# EAGLE design Sternchen (EAGLE 4.15)
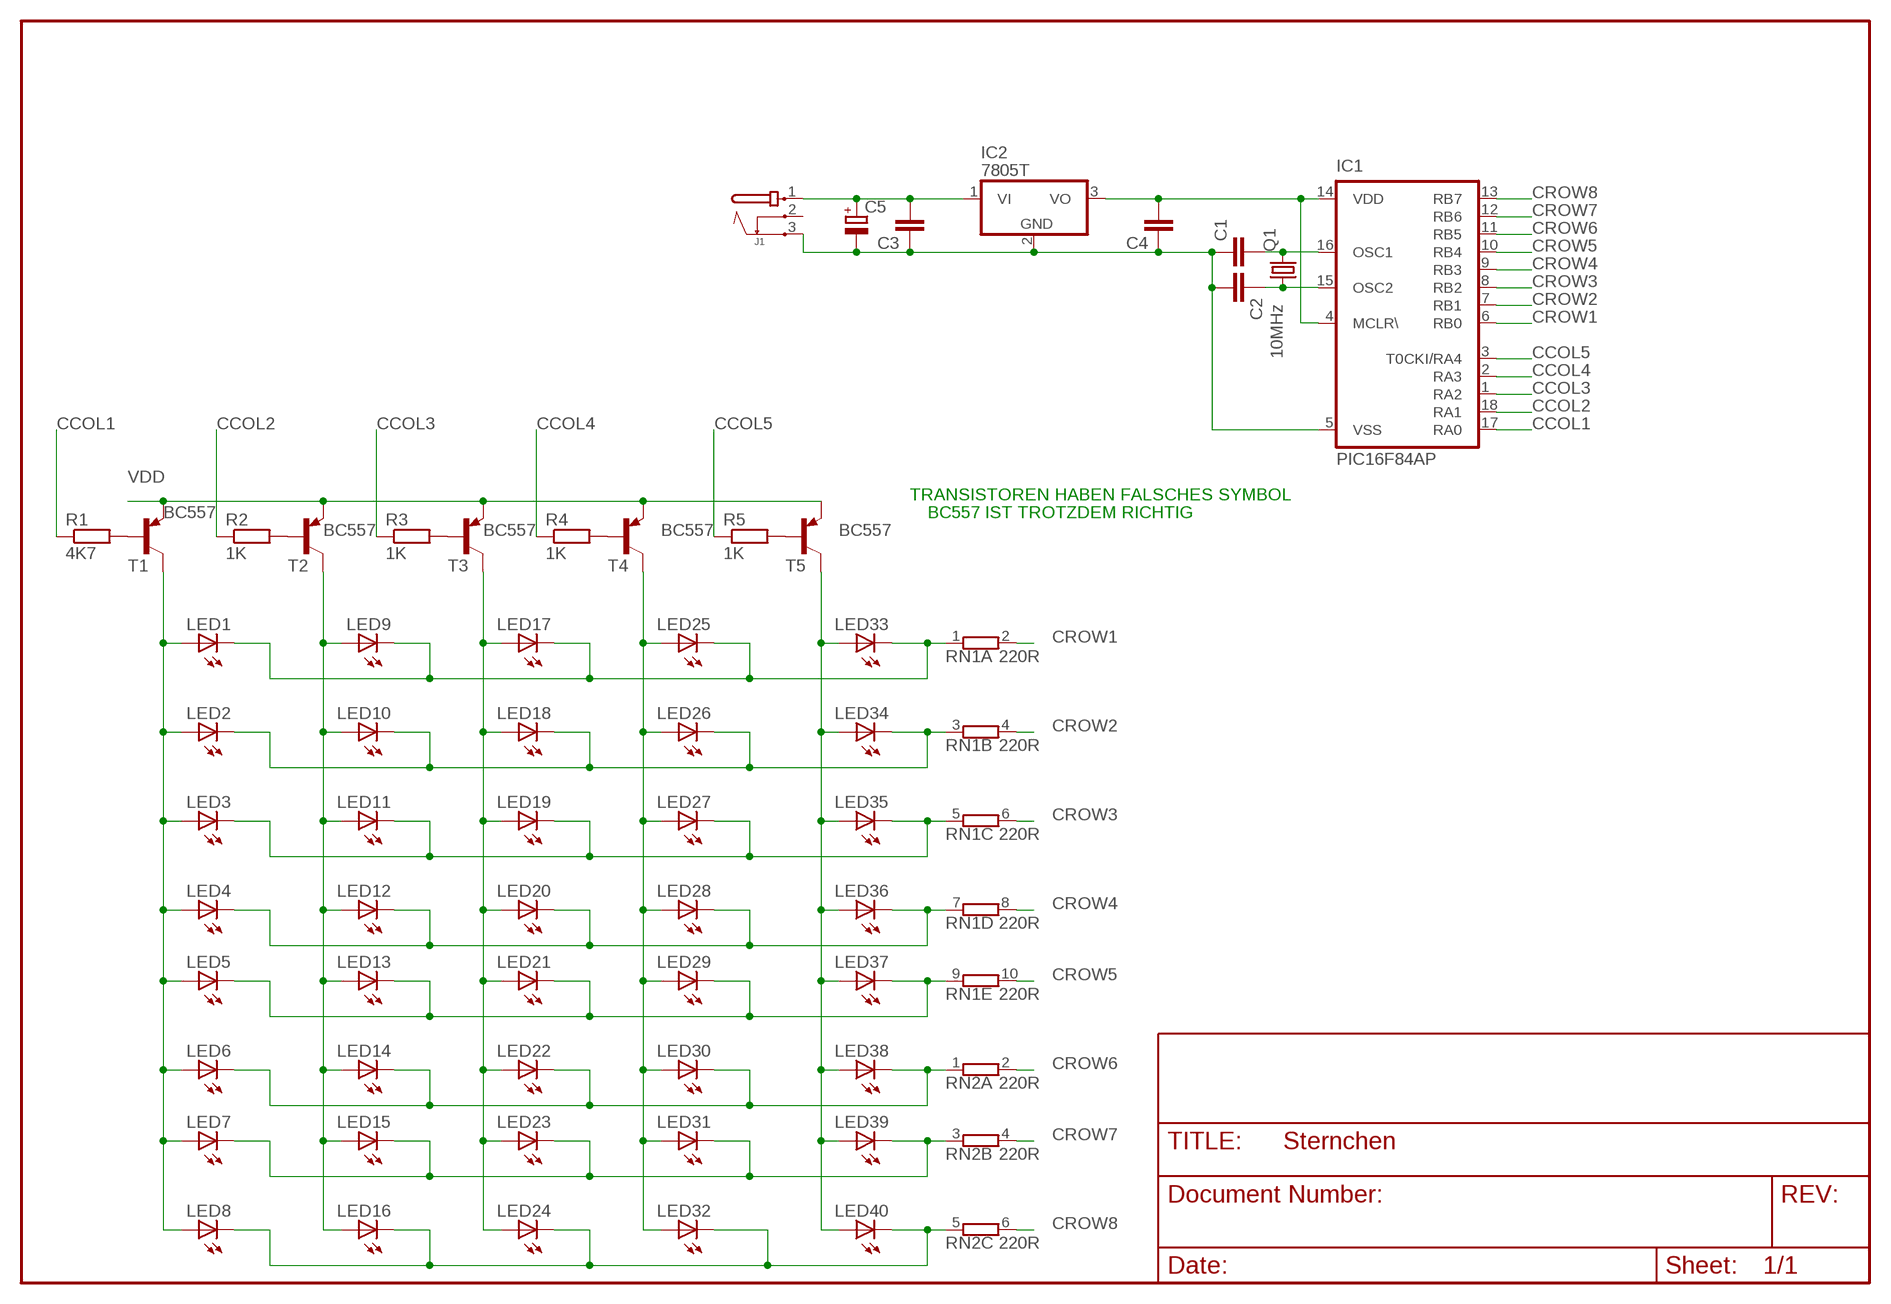
[diagram p0: schematic, sheet 1]

## Parts
C1  C2,5-3  [C2.5-3]
C2  C2,5-3  [C2.5-3]
C3  C2,5-3  [C2.5-3]
C4  C2,5-3  [C2.5-3]
C5  CPOL-EUE1.8-4  [E1,8-4]
IC1  PIC16F84AP  [DIL18]
IC2  7805T  [TO220H]
J1  JACK-PMS  [JACK-PMS]
LED1  LED5MM  [LED5MM]
LED2  LED5MM  [LED5MM]
LED3  LED5MM  [LED5MM]
LED4  LED5MM  [LED5MM]
LED5  LED5MM  [LED5MM]
LED6  LED5MM  [LED5MM]
LED7  LED5MM  [LED5MM]
LED8  LED5MM  [LED5MM]
LED9  LED3MM  [LED3MM]
LED10  LED3MM  [LED3MM]
LED11  LED3MM  [LED3MM]
LED12  LED3MM  [LED3MM]
LED13  LED3MM  [LED3MM]
LED14  LED3MM  [LED3MM]
LED15  LED3MM  [LED3MM]
LED16  LED3MM  [LED3MM]
LED17  LED3MM  [LED3MM]
LED18  LED3MM  [LED3MM]
LED19  LED3MM  [LED3MM]
LED20  LED3MM  [LED3MM]
LED21  LED3MM  [LED3MM]
LED22  LED3MM  [LED3MM]
LED23  LED3MM  [LED3MM]
LED24  LED3MM  [LED3MM]
LED25  LED3MM  [LED3MM]
LED26  LED3MM  [LED3MM]
LED27  LED3MM  [LED3MM]
LED28  LED3MM  [LED3MM]
LED29  LED3MM  [LED3MM]
LED30  LED3MM  [LED3MM]
LED31  LED3MM  [LED3MM]
LED32  LED3MM  [LED3MM]
LED33  LED3MM  [LED3MM]
LED34  LED5MM  [LED5MM]
LED35  LED3MM  [LED3MM]
LED36  LED3MM  [LED3MM]
LED37  LED3MM  [LED3MM]
LED38  LED3MM  [LED3MM]
LED39  LED3MM  [LED3MM]
LED40  LED3MM  [LED3MM]
Q1  10MHz  CRYTALHC49S  [HC49/S]
R1  4K7  R-EU_0204/2V  [0204V]
R2  1K  R-EU_0204/2V  [0204V]
R3  1K  R-EU_0204/2V  [0204V]
R4  1K  R-EU_0204/2V  [0204V]
R5  1K  R-EU_0204/2V  [0204V]
RN1  220R  E5R  [SIL10]
RN2  220R  E5R  [SIL10]
T1  BC557  -PNP-TO92  [TO92]
T2  BC557  -PNP-TO92  [TO92]
T3  BC557  -PNP-TO92  [TO92]
T4  BC557  -PNP-TO92  [TO92]
T5  BC557  -PNP-TO92  [TO92]

## Nets
CCOL1: IC1.17(RA0) R1.1
CCOL2: IC1.18(RA1) R2.1
CCOL3: IC1.1(RA2) R3.1
CCOL4: IC1.2(RA3) R4.1
CCOL5: IC1.3(T0CKI/RA4) R5.1
COL1: LED1.A LED2.A LED3.A LED4.A LED5.A LED6.A LED7.A LED8.A T1.3(C)
COL2: LED9.A LED10.A LED11.A LED12.A LED13.A LED14.A LED15.A LED16.A T2.3(C)
COL3: LED17.A LED18.A LED19.A LED20.A LED21.A LED22.A LED23.A LED24.A T3.3(C)
COL4: LED25.A LED26.A LED27.A LED28.A LED29.A LED30.A LED31.A LED32.A T4.3(C)
COL5: LED33.A LED34.A LED35.A LED36.A LED37.A LED38.A LED39.A LED40.A T5.3(C)
CROW1: IC1.6(RB0) RN1.2
CROW2: IC1.7(RB1) RN1.4
CROW3: IC1.8(RB2) RN1.6
CROW4: IC1.9(RB3) RN1.8
CROW5: IC1.10(RB4) RN1.10
CROW6: IC1.11(RB5) RN2.2
CROW7: IC1.12(RB6) RN2.4
CROW8: IC1.13(RB7) RN2.6
N$1: C1.2 IC1.16(OSC1) Q1.2
N$2: C2.1 IC1.15(OSC2) Q1.1
N$3: R1.2 T1.2(B)
N$4: C3.2 C5.+ IC2.1(VI) J1.1
N$5: R2.2 T2.2(B)
N$6: C1.1 C2.2 C3.1 C4.1 C5.- IC1.5(VSS) IC2.2(GND) J1.3
N$7: R3.2 T3.2(B)
N$8: R4.2 T4.2(B)
N$9: R5.2 T5.2(B)
ROW1: LED1.K(C) LED9.K(C) LED17.K(C) LED25.K(C) LED33.K(C) RN1.1
ROW2: LED2.K(C) LED10.K(C) LED18.K(C) LED26.K(C) LED34.K(C) RN1.3
ROW3: LED3.K(C) LED11.K(C) LED19.K(C) LED27.K(C) LED35.K(C) RN1.5
ROW4: LED4.K(C) LED12.K(C) LED20.K(C) LED28.K(C) LED36.K(C) RN1.7
ROW5: LED5.K(C) LED13.K(C) LED21.K(C) LED29.K(C) LED37.K(C) RN1.9
ROW6: LED6.K(C) LED14.K(C) LED22.K(C) LED30.K(C) LED38.K(C) RN2.1
ROW7: LED7.K(C) LED15.K(C) LED23.K(C) LED31.K(C) LED39.K(C) RN2.3
ROW8: LED8.K(C) LED16.K(C) LED24.K(C) LED32.K(C) LED40.K(C) RN2.5
VDD: C4.2 IC1.4(MCLR\) IC1.14(VDD) IC2.3(VO) T1.1(E) T2.1(E) T3.1(E) T4.1(E) T5.1(E)
Unconnected: J1.2 RN2.7 RN2.8 RN2.9 RN2.10

## Notes on the sheet
- TRANSISTOREN HABEN FALSCHES SYMBOL
- BC557 IST TROTZDEM RICHTIG

## Library data of the parts
C1-C4 = capacitor-wima:C: CAPACITOR naming: grid - package width
C5 = rcl:CPOL-EU: POLARIZED CAPACITOR, European symbol
IC1 = microchip:PIC16F8*: MICROCONTROLLER 8-Bit PIC16F8X Family - CMOS Flash/EEPROM Pin Compatible : PIC16F83, PIC16CR83, PIC16F84A, PIC16CR84 see also PIC16C*
IC2 = linear:78*: Positive VOLTAGE REGULATOR Source: http://cache.national.com/ds/LM/LM78L05.pdf http://www.fairchildsemi.com/ds/LM/LM7805.pdf
J1 = POWER-IN:JACK-PMS
LED1-LED40 = led:LED: LED OSRAM: - CHIPLED LG R971, LG N971, LY N971, LG Q971, LY Q971, LO R971, LY R971 LH N974, LH R974 LS Q976, LO Q976, LY Q976 LO Q996 - Hyper CHIPLED LW Q18S LB Q993, LB Q99A, LB R99A - SideLED LS A670, LO A670, LY A670, LG A670, LP A670 LB A673, LV A673, LT A673, LW A673 LH A674 LY A675 LS A676, LA A676, LO A676, LY A676, LW A676 LS A679, LY A679, LG A679 - Hyper Micro SIDELED® LS Y876, LA Y876, LO Y876, LY Y876 LT Y87S - SmartLED LW L88C, LW L88S LB L89C, LB L89S, LG L890 LS L89K, LO L89K, LY L89K LS L896, LA L896, LO L896, LY L896 - TOPLED LS T670, LO T670, LY T670, LG T670, LP T670 LSG T670, LSP T670, LSY T670, LOP T670, LYG T670 LG T671, LOG T671, LSG T671 LB T673, LV T673, LT T673, LW T673 LH T674 LS T676, LA T676, LO T676, LY T676, LB T676, LH T676, LSB T676, LW T676 LB T67C, LV T67C, LT T67C, LS T67K, LO T67K, LY T67K, LW E67C LS E67B, LA E67B, LO E67B, LY E67B, LB E67C, LV E67C, LT E67C LW T67C LS T679, LY T679, LG T679 LS T770, LO T770, LY T770, LG T770, LP T770 LB T773, LV T773, LT T773, LW T773 LH T774 LS E675, LA E675, LY E675, LS T675 LS T776, LA T776, LO T776, LY T776, LB T776 LHGB T686 LT T68C, LB T68C - Hyper Mini TOPLED® LB M676 - Mini TOPLED Santana® LG M470 LS M47K, LO M47K, LY M47K Source: http://www.osram.convergy.de/
Q1 = crystal:CRYTAL: CRYSTAL
R1-R5 = rcl:R-EU_: RESISTOR, European symbol
RN1 RN2 = resistor-sil:E5R: SIL RESISTOR
T1-T5 = transistor:*-PNP-: PNP Transistror

## Net classes
0 default: width 0.5 mm

## Board
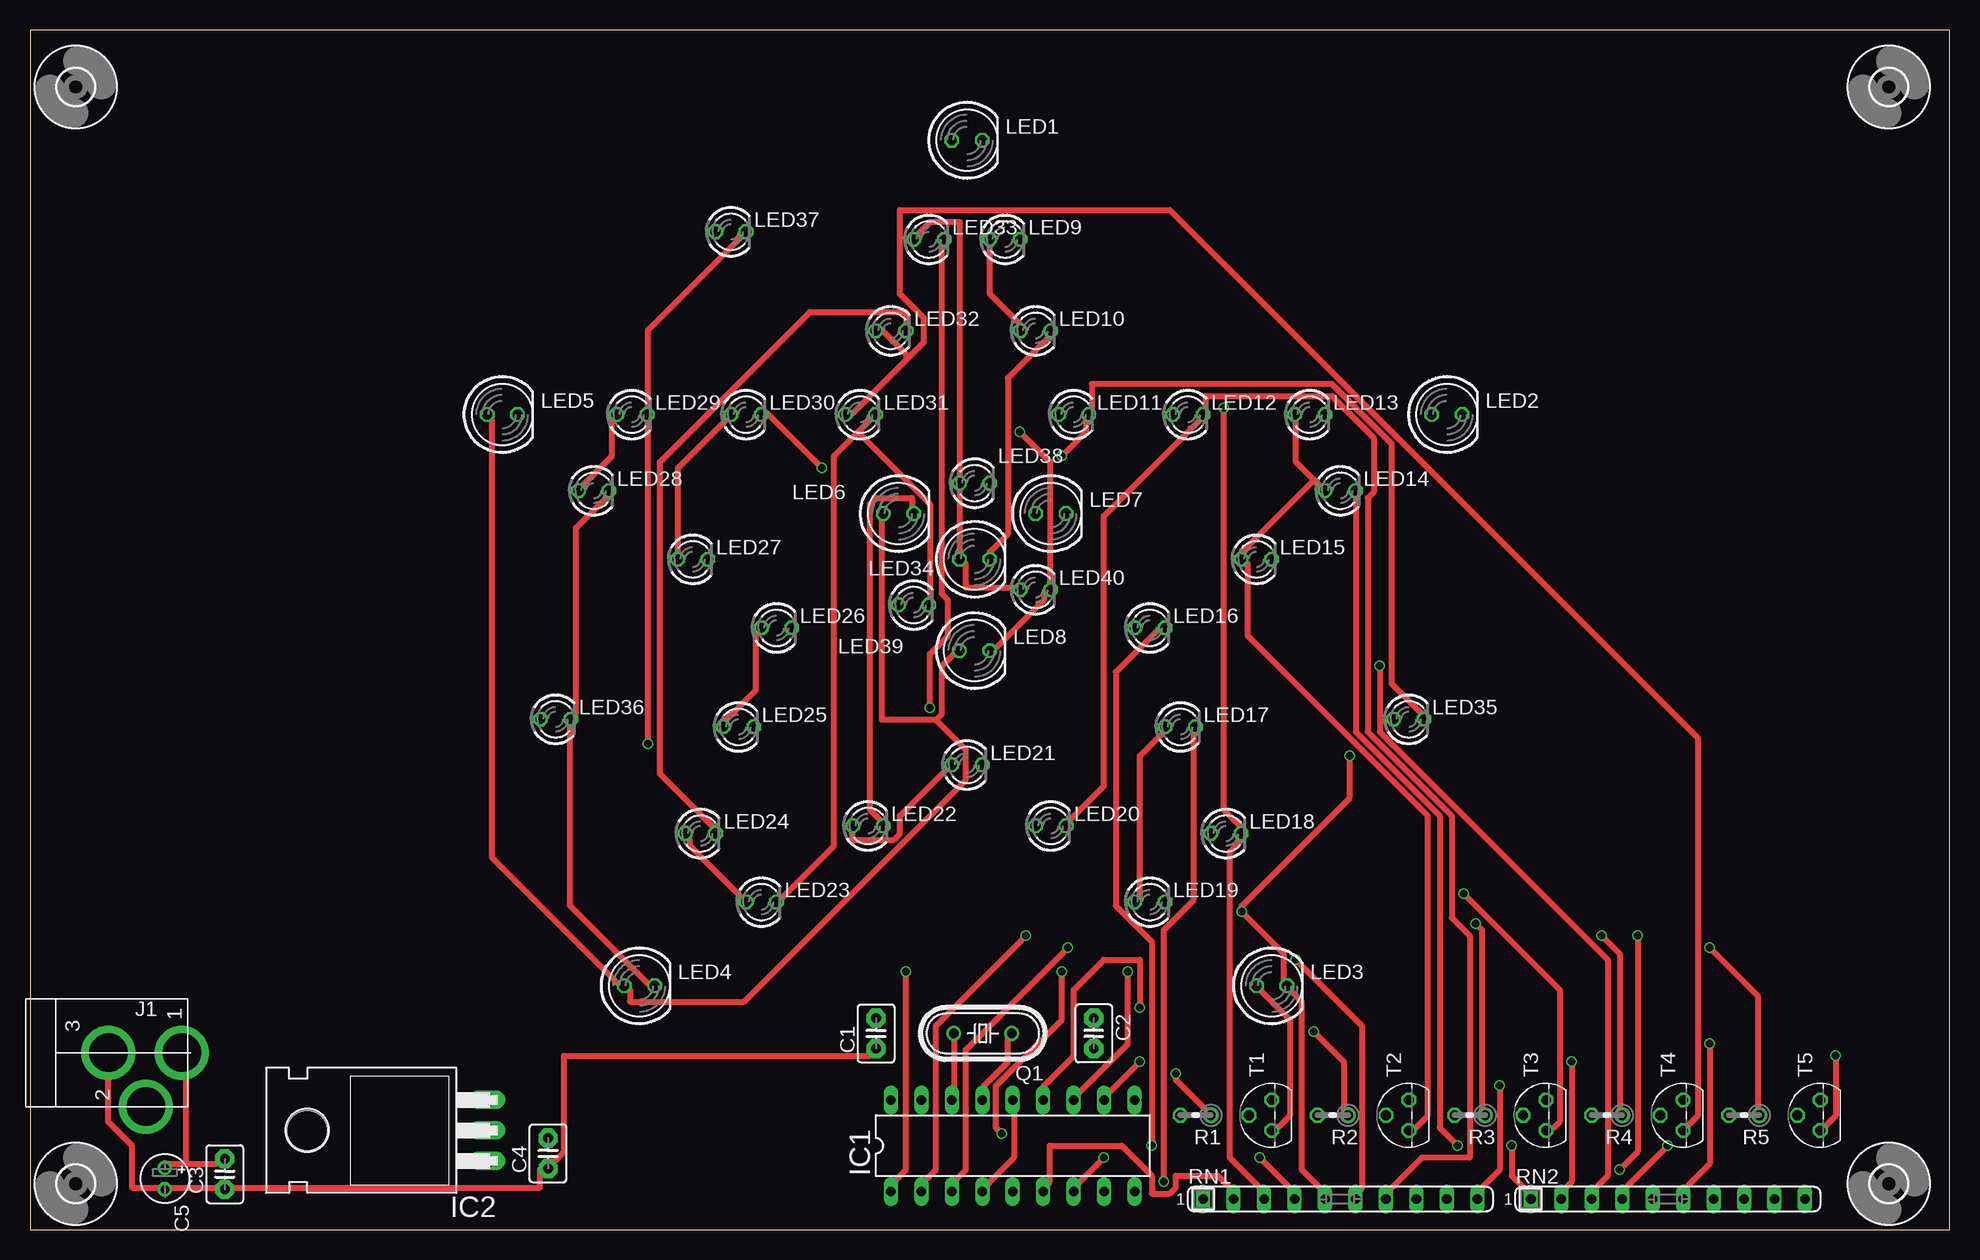
[diagram p1: board, top side]
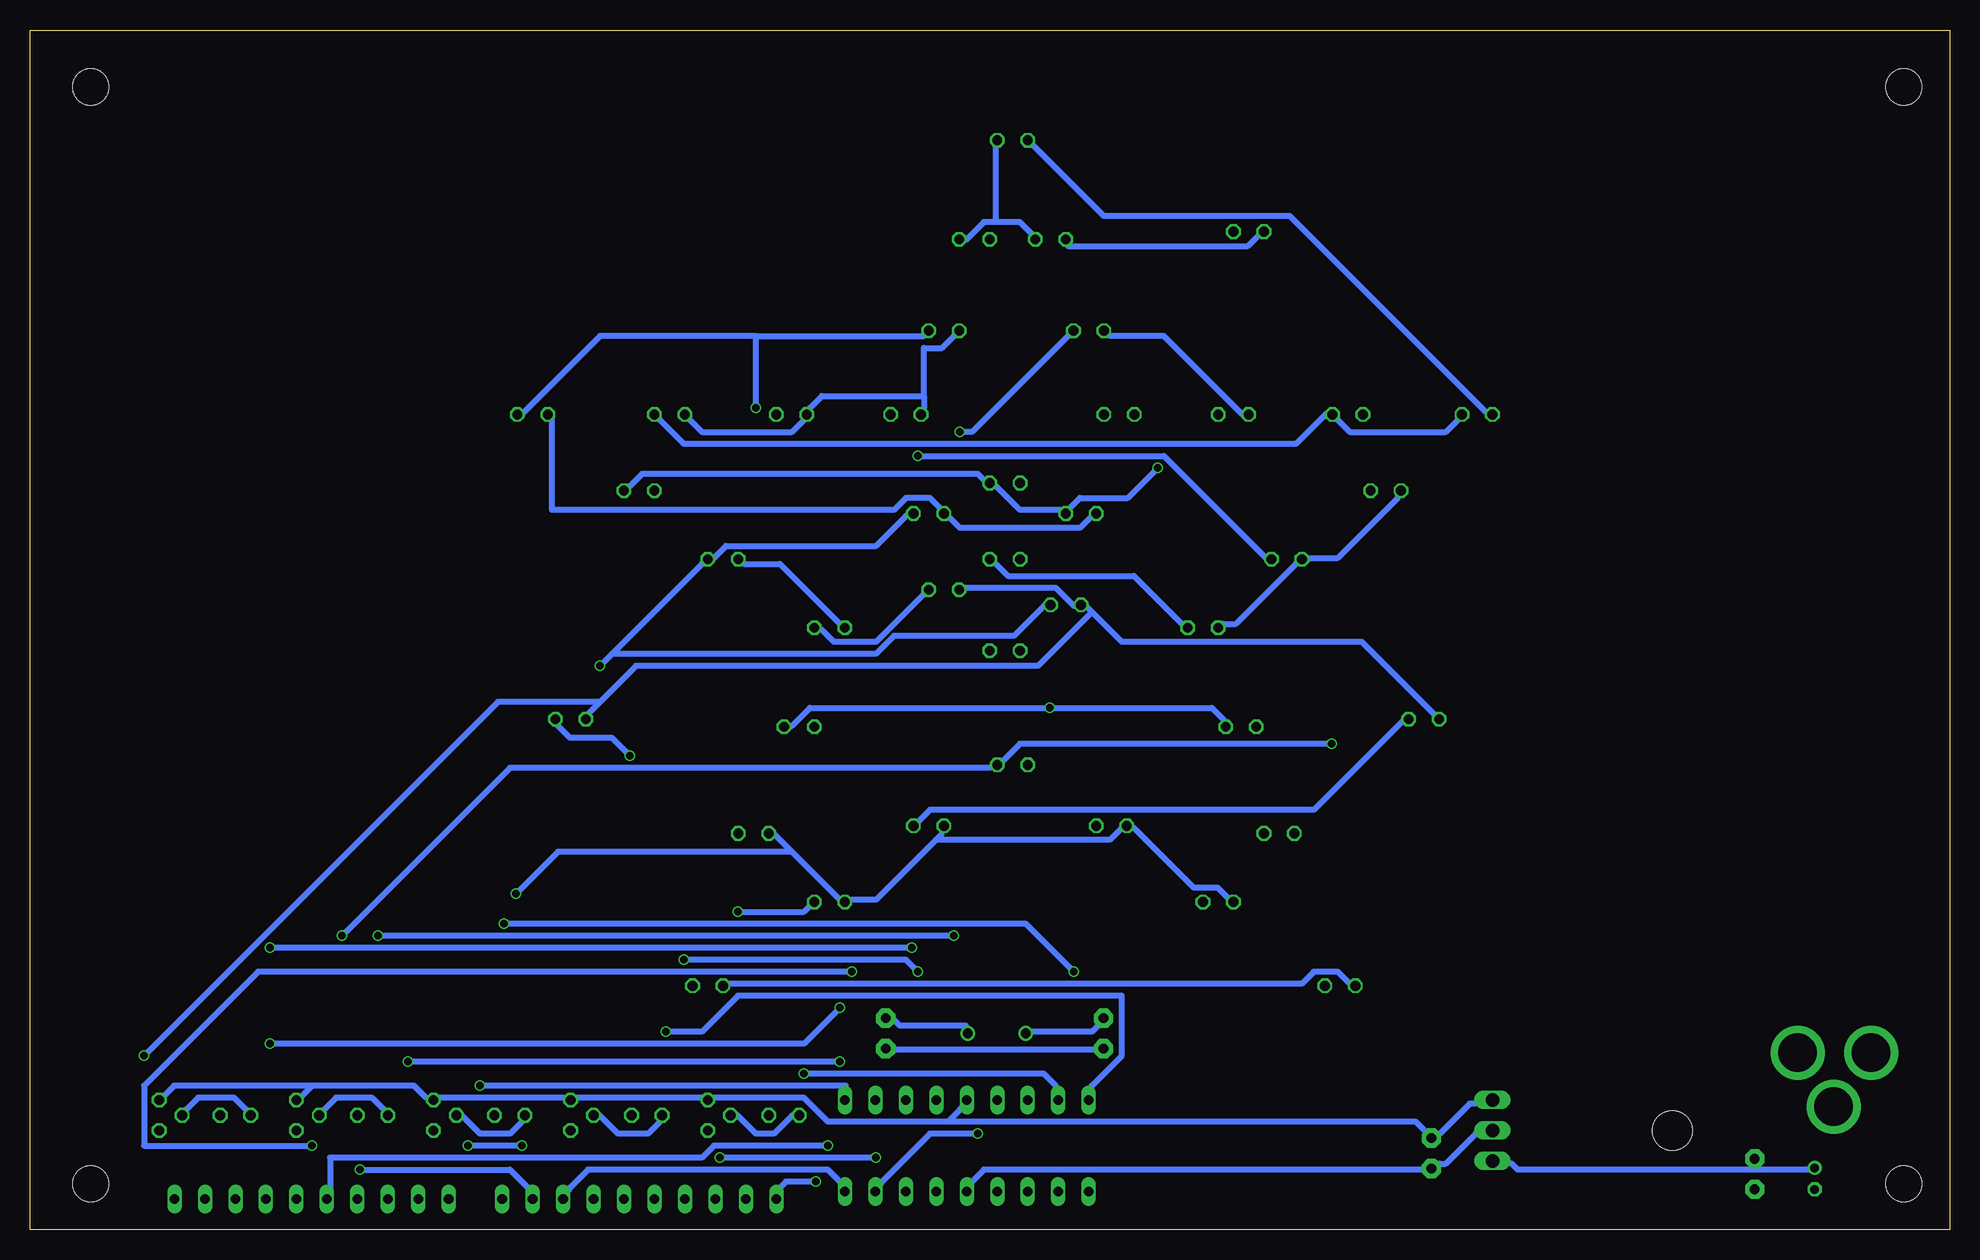
[diagram p2: board, bottom side, seen from below]

Size 160 x 100 mm. Coordinates in mm from the lower left corner, seen from the top.
Outline: 0,0 160,0 160,100 0,100 0,0
Copper layers (1*16): Top 0.035mm / dielectric 1.5mm / Bottom 0.035mm
Design rules "PCB-POOL": minimum track width 6mil, minimum drill 12mil, track to track 6mil, track to pad 6mil, pad to pad 6mil, via to via 6mil, smd to smd 6mil, copper to edge 20mil, drill to drill 8mil, minimum pad ring 8mil, minimum via ring 6mil, stop-mask expansion 3mil, vias tented up to drill 0mil, thermal gap 8mil

### Footprints (pad centres in the part's own frame; a part is rotated, then mirrored left to right if it is on the bottom)
C2.5-3 = drill 0.813 pad 1.6 octagon: 1 -1.27,0; 2 1.27,0
E1,8-4 = drill 0.711 pad 1.168 round: + -0.889,0 | drill 0.711 pad 1.168 octagon: - 0.889,0
DIL18 = drill 0.813 long: 1 -10.16,-3.81; 2 -7.62,-3.81; 3 -5.08,-3.81; 4 -2.54,-3.81; 5 0,-3.81; 6 2.54,-3.81; 7 5.08,-3.81; 8 7.62,-3.81; 9 10.16,-3.81; 10 10.16,3.81; 11 7.62,3.81; 12 5.08,3.81; 13 2.54,3.81; 14 0,3.81; 15 -2.54,3.81; 16 -5.08,3.81; 17 -7.62,3.81; 18 -10.16,3.81
TO220H = drill 1.118 long: 1 -2.54,-10.16; 2 0,-10.16; 3 2.54,-10.16 | hole 3.302: 0,4.826
JACK-PMS = drill 3.2 pad 4.5 round: 1 -0.5,-3.31; 2 -5,-0.31; 3 -0.5,2.809
LED5MM = drill 0.813 octagon: A -1.27,0; K 1.27,0
LED3MM = drill 0.813 octagon: A -1.27,0; K 1.27,0
HC49/S = drill 0.813 round: 1 -2.413,0; 2 2.413,0
0204V = drill 0.813 octagon: 1 -1.27,0; 2 1.27,0
SIL10 = drill 0.813 long: 1 -11.43,0; 2 -8.89,0; 3 -6.35,0; 4 -3.81,0; 5 -1.27,0; 6 1.27,0; 7 3.81,0; 8 6.35,0; 9 8.89,0; 10 11.43,0
TO92 = drill 0.813 octagon: 1 1.27,0; 2 0,1.905; 3 -1.27,0
3,0 = hole 3: 0,0

### Placement (x,y rotation side)
C1  70.53,16.35 90 top
C2  88.67,16.35 270 top
C3  16.24,4.62 90 top
C4  43.18,6.35 90 top
C5  11.24,4.24 270 top
IC1  81.92,6.99 0 top
IC2  27.94,8.26 90 top
J1  9.35,15.24 90 top
LED1  78.11,90.81 0 top
LED2  118.11,67.94 0 top
LED3  103.5,20.32 0 top
LED4  50.8,20.32 0 top
LED5  39.37,67.94 0 top
LED6  72.39,59.69 0 top
LED7  85.09,59.69 0 top
LED8  78.74,48.26 0 top
LED9  81.28,82.55 0 top
LED10  83.82,74.93 0 top
LED11  87,67.94 0 top
LED12  96.52,67.94 0 top
LED13  106.68,67.94 0 top
LED14  109.22,61.59 0 top
LED15  102.23,55.88 0 top
LED16  93.34,50.16 0 top
LED17  95.89,41.91 0 top
LED18  99.69,33.02 0 top
LED19  93.34,27.3 0 top
LED20  85.09,33.66 0 top
LED21  78.11,38.73 0 top
LED22  69.85,33.66 0 top
LED23  60.96,27.3 0 top
LED24  55.88,33.02 0 top
LED25  59.05,41.91 0 top
LED26  62.23,50.16 0 top
LED27  55.24,55.88 0 top
LED28  46.99,61.59 0 top
LED29  50.16,67.94 0 top
LED30  59.69,67.94 0 top
LED31  69.22,67.94 0 top
LED32  71.75,74.93 0 top
LED33  74.93,82.55 0 top
LED34  78.74,55.88 0 top
LED35  114.94,42.55 0 top
LED36  43.81,42.55 0 top
LED37  58.42,83.19 0 top
LED38  78.74,62.23 0 top
LED39  73.66,52.07 0 top
LED40  83.82,53.34 0 top
Q1  79.42,16.35 180 top
R1  97.16,9.53 180 top
R2  108.58,9.53 180 top
R3  120.02,9.53 180 top
R4  131.44,9.53 180 top
R5  142.88,9.53 180 top
RN1  109.22,2.54 0 top
RN2  136.53,2.54 0 top
T1  103.5,9.53 90 top
T2  114.94,9.53 90 top
T3  126.36,9.53 90 top
T4  137.79,9.53 90 top
T5  149.22,9.53 90 top
U$1  [3,0]  3.81,95.25 0 top
U$2  [3,0]  154.94,95.25 0 top
U$3  [3,0]  154.94,3.81 0 top
U$4  [3,0]  3.81,3.81 0 top

### Tracks (layer width: path | path; a pad name or v marks a point on that pad's centre or on a via)
CCOL1  (via drill 0.61)
  Top 0.5: v95.5,13 95.5,12.5 98,10 R1.1
  Bottom 0.5: v95.5,13 75.5,13 74.5,12 IC1.17
CCOL2  (via drill 0.61)
  Top 0.5: v107,16.5 109.5,14 109.5,10 R2.1
  Bottom 0.5: v107,16.5 104,16.5 101,19.5 69,19.5 69,14.5 71.5,12 IC1.18
CCOL3  (via drill 0.61)
  Top 0.5: v73,21.5 73,5 72,4 IC1.1 | v120.5,25.5 121,25 121,10 R3.1
  Bottom 0.5: v73,21.5 77,25.5 v120.5,25.5
CCOL4  (via drill 0.61)
  Top 0.5: v83,24.5 75.5,17 75.5,5 74.5,4 IC1.2 | v131,24.5 132.5,23 132.5,10 R4.1
  Bottom 0.5: v83,24.5 v131,24.5
CCOL5  (via drill 0.61)
  Top 0.5: v86.5,23.5 78,15 78,5 77,4 IC1.3 | v140,23.5 144,19.5 144,10 R5.1
  Bottom 0.5: v86.5,23.5 v140,23.5
COL1
  Top 0.5: 75.5,42.5 76,43 76,47 77,48 LED8.A | 75.5,42.5 71,42.5 71,59.5 LED6.A | T1.3 104,8.5 105,9.5 105,17.5 102.5,20 LED3.A | LED5.A 38.5,67.5 38.5,31 49,20.5 LED4.A 50,20 50,19 59.5,19 78,37.5 78,40 75.5,42.5
  Bottom 0.5: LED6.A 71.5,59.5 72.5,58.5 82.5,58.5 83.5,59.5 LED7.A 84,60 85,61 87,61 88,60 116.5,60 116.5,67.5 LED2.A | LED1.A 76.5,90.5 70.5,84.5 55,84.5 38.5,68 LED5.A | LED3.A 102,20.5 54,20.5 53,21.5 51,21.5 50,20.5 LED4.A
COL2
  Top 0.5: LED10.A 82.5,75.5 80,78 80,82 LED9.A | 107,62.5 105.5,64 105.5,67.5 LED13.A | 107,62.5 107.5,62 LED14.A | T2.3 115.5,8.5 116.5,9.5 116.5,34.5 101.5,49.5 101.5,55.5 LED15.A 101,56.5 107,62.5
  Bottom 0.5: 85.5,69.5 85.5,73.5 84,73.5 83,74.5 LED10.A | 85.5,69.5 85.5,68.5 LED11.A | 85.5,69.5 94,69.5 95,68.5 LED12.A 95.5,67.5 96.5,66.5 104,66.5 105,67.5 LED13.A | LED16.A 92.5,50.5 97.5,55.5 100.5,55.5 LED15.A
COL3  (via drill 0.61)
  Top 0.5: LED23.A 59.5,27.5 55,32 55,32.5 LED24.A | LED21.A 76.5,38.5 72.5,34.5 72.5,33 72,32.5 68.5,32.5 68.5,33 LED22.A | v119.5,28 127.5,20 127.5,9 127,8.5 T3.3 | LED17.A 94.5,41.5 92.5,39.5 92.5,27.5 LED19.A
  Bottom 0.5: LED23.A 60,27.5 61,28.5 63,28.5 68,33.5 LED22.A 69,33.5 70,32.5 84.5,32.5 | 96.5,31.5 98,33 LED18.A | 96.5,31.5 92.5,27.5 LED19.A 91.5,27.5 89.5,27.5 84.5,32.5 | v119.5,28 116,31.5 96.5,31.5 | 84.5,32.5 84,33 LED20.A
COL4
  Top 0.5: LED28.A 46,62 48.5,64.5 48.5,67.5 LED29.A | LED25.A 58,42.5 60.5,45 60.5,50 LED26.A | LED30.A 58,67.5 54,63.5 54,56.5 LED27.A | 73,72.5 68.5,68 LED31.A | 73,72.5 74.5,74 74.5,76 72.5,78 72.5,85 95,85 139,41 139,9.5 138,8.5 T4.3 | 73,72.5 73,73 71,75 LED32.A
  Bottom 0.5: LED26.A 60.5,50.5 59.5,50.5 54.5,55.5 LED27.A 53.5,56 51,56 46,61 LED28.A | LED30.A 59,68 65.5,74.5 70,74.5 LED32.A
COL5  (via drill 0.61)
  Top 0.5: LED40.A 82,53.5 78,53.5 78,55.5 LED34.A 77.5,56.5 77.5,62 LED38.A 77.5,62.5 77.5,84 75,84 74,83 LED33.A | v150.5,14.5 150.5,9.5 149.5,8.5 T5.3
  Bottom 0.5: LED37.A 57.5,83 58.5,82 73.5,82 LED33.A | 71.5,51.5 72,52 LED39.A 73,52 74.5,53.5 82,53.5 LED40.A | 71.5,51.5 69,49 49,49 LED36.A | 112.5,44 109.5,47 76,47 71.5,51.5 | 112.5,44 113.5,43 LED35.A | v150.5,14.5 121,44 112.5,44
CROW1
  Top 0.5: RN1.2 100,3.5 99,4.5 95.5,4.5 95.5,3.5 95,3 93.5,3 93.5,4.5 91,7 85,7 85,4 IC1.6
CROW2  (via drill 0.61)
  Top 0.5: v102.5,6 105,3.5 RN1.4 | v89.5,6 87.5,4 IC1.7
  Bottom 0.5: v89.5,6 v102.5,6
CROW3  (via drill 0.61)
  Top 0.5: v81,8 80.5,8.5 80.5,12 86,17.5 v86,21.5 | v105.5,22.5 111,17 111,3.5 RN1.6
  Bottom 0.5: v81,8 85,8 89,4 IC1.8 | v86,21.5 87,22.5 v105.5,22.5
CROW4
  Bottom 0.5: IC1.9 92.5,4 93.5,5 113.5,5 115,3.5 RN1.8
CROW5  (via drill 0.61)
  Top 0.5: v122.5,12 122.5,5 121,3.5 RN1.10
  Bottom 0.5: v122.5,12 92,12 IC1.10
CROW6  (via drill 0.61)
  Top 0.5: v92.5,14 90,11.5 IC1.11 | v128.5,14 128.5,4 128,3.5 RN2.2
  Bottom 0.5: v92.5,14 v128.5,14
CROW7  (via drill 0.61)
  Top 0.5: v91.5,21.5 91.5,15.5 87.5,11.5 IC1.12 | v136.5,7 133,3.5 RN2.4
  Bottom 0.5: v91.5,21.5 141,21.5 150.5,12 150.5,7 v136.5,7
CROW8  (via drill 0.61)
  Top 0.5: v92.5,18.5 92.5,22.5 89.5,22.5 87,20 87,14.5 84.5,12 IC1.13 | v140,15.5 140,5.5 138,3.5 RN2.6
  Bottom 0.5: v92.5,18.5 95.5,15.5 v140,15.5
N$1
  Top 0.5: IC1.16 77,12 77,16 Q1.2
  Bottom 0.5: C1.2 71,17 71.5,16.5 76.5,16.5 Q1.2
N$2
  Top 0.5: IC1.15 79.5,12 81.5,14 81.5,16 Q1.1
  Bottom 0.5: C2.1 88,17.5 87.5,17 82,17 Q1.1
N$3
  Bottom 0.5: R1.2 96.5,9.5 98,8 99.5,8 101,9.5 T1.2
N$4
  Top 0.5: 13,5.5 15.5,5.5 C3.2 | 13,5.5 11.5,5.5 C5.+ | 13,5.5 13,12.5 J1.1
  Bottom 0.5: IC2.1 36.5,5.5 36,5 11.5,5 C5.+
N$5
  Bottom 0.5: R2.2 107.5,9 108.5,8 111,8 112.5,9.5 T2.2
N$6
  Top 0.5: J1.3 6.5,12.5 6.5,9 8.5,7 8.5,3.5 11,3.5 C5.- 11.5,3.5 15.5,3.5 C3.1 17,3.5 42.5,3.5 42.5,5 C4.1 43.5,5.5 44.5,6.5 44.5,14.5 70,14.5 C1.1
  Bottom 0.5: C1.1 71,15 88,15 C2.2 | IC1.5 81.5,4 80.5,5 43.5,5 C4.1 42.5,5.5 42,5.5 39.5,8 IC2.2
N$7
  Bottom 0.5: R3.2 119,9 120,8 122.5,8 124,9.5 T3.2
N$8
  Bottom 0.5: R4.2 130.5,10 131.5,11 134.5,11 135.5,10 T4.2
N$9
  Bottom 0.5: R5.2 142,10 143,11 146,11 147,10 T5.2
ROW1  (via drill 0.61)
  Top 0.5: v94.5,4 94.5,25 97,27.5 97,41.5 LED17.K | v75,43.5 75,48 76.5,49.5 76.5,52.5 76,53 76,82 LED33.K
  Bottom 0.5: 79.5,84 80.5,84 82,82.5 LED9.K | 79.5,84 77.5,84 76.5,83 LED33.K | 79.5,84 79.5,90.5 LED1.K | LED25.K 60.5,42.5 61.5,43.5 v75,43.5 95,43.5 96.5,42 LED17.K | v94.5,4 97,4 97.5,3.5 RN1.1
ROW2  (via drill 0.61)
  Top 0.5: RN1.3 102.5,3.5 100,6 100,31.5 101,32.5 LED18.K 101,33.5 99.5,35 v99.5,68.5 | LED10.K 85,74.5 81.5,71 81.5,58 80,56.5 LED34.K
  Bottom 0.5: LED26.K 64,50.5 68,54.5 78.5,54.5 79.5,55.5 LED34.K | 99.5,74.5 85.5,74.5 LED10.K | 99.5,74.5 112.5,74.5 119,68 LED2.K | v99.5,68.5 99.5,74.5
ROW3  (via drill 0.61)
  Top 0.5: RN1.5 107.5,3.5 106,5 106,19 105,20 LED3.K 104.5,20.5 104.5,23 v101,26.5 101,27 110,36 v110,39.5 | LED35.K 116,43 113.5,45.5 113.5,65.5 108.5,70.5 88.5,70.5 88.5,68.5 LED11.K 88,67.5 88,66.5 v86,64.5
  Bottom 0.5: v101,26.5 95.5,26.5 95,27 LED19.K | v86,64.5 65.5,64.5 57,56 LED27.K | v110,39.5 111.5,41 115,41 116,42 LED35.K
ROW4
  Top 0.5: LED4.K 51.5,20.5 45,27 45,42 LED36.K 45.5,43 45.5,58.5 48,61 LED28.K | LED20.K 86.5,34 89.5,37 89.5,59.5 97.5,67.5 LED12.K 98,68.5 98,69.5 108.5,69.5 112,66 112,61.5 111.5,61 111.5,41.5 118.5,34.5 118.5,26 120,24.5 120,6 116,6 113.5,3.5 RN1.7
  Bottom 0.5: LED36.K 45.5,42.5 53,35 85,35 86,34 LED20.K
ROW5  (via drill 0.61)
  Top 0.5: v51.5,40.5 51.5,67.5 LED29.K 51.5,68.5 51.5,75 59.5,83 LED37.K | v132.5,5 134,6.5 v134,24.5
  Bottom 0.5: v51.5,40.5 77.5,40.5 79,39 LED21.K 80,38.5 120,38.5 v134,24.5 | v132.5,5 120,5 118.5,3.5 RN1.9 | LED5.K 41,67.5 42,66.5 50,66.5 51,67.5 LED29.K 52,68 54.5,65.5 105.5,65.5 107.5,67.5 LED13.K
ROW6  (via drill 0.61)
  Top 0.5: LED22.K 71,34 70,35 70,60.5 70.5,61 73.5,61 73.5,60 LED6.K | v66,63.5 61.5,68 LED30.K | v123.5,7 123.5,4.5 124.5,3.5 RN2.1 | v119,7 117.5,8.5 117.5,34.5 110.5,41.5 110.5,61 LED14.K
  Bottom 0.5: v66,63.5 68.5,61 72.5,61 73.5,60 LED6.K 74,60 77.5,60 79.5,62 LED38.K 80.5,62.5 81,63 109,63 110,62 LED14.K | v119,7 v123.5,7
ROW7  (via drill 0.61)
  Top 0.5: 69,66.5 70,67.5 LED31.K | 69,66.5 67,64.5 67,32 62.5,27.5 LED23.K | 69,66.5 75,60.5 75,52.5 LED39.K | v112.5,47 112.5,41.5 131.5,22.5 131.5,4.5 130.5,3.5 RN2.3
  Bottom 0.5: 111.5,48 104,55.5 LED15.K 103,56 102,57 89.5,57 87,59.5 LED7.K | 111.5,48 v112.5,47 | 111.5,48 89.5,48 88,49.5 78,49.5 75.5,52 LED39.K
ROW8  (via drill 0.61)
  Top 0.5: LED24.K 57,33.5 52.5,38 52.5,64 65,76.5 73,76.5 73,75.5 LED32.K | LED8.K 80.5,48.5 84.5,52.5 84.5,53 LED40.K 85,54 85,64 v82.5,66.5 | v93.5,7 93.5,24 90.5,27 90.5,46.5 94,50 LED16.K
  Bottom 0.5: v93.5,7 103,7 104,6 135,6 135,3.5 RN2.5 | LED40.K 85.5,53 89.5,49 93,49 94,50 LED16.K | v82.5,66.5 81.5,66.5 73.5,74.5 LED32.K
VDD
  Top 0.5: IC1.4 80,4 82,6 82,9.5 IC1.14
  Bottom 0.5: IC2.3 39.5,10.5 40,10.5 42.5,8 C4.2 43.5,8 44.5,9 83.5,9 | 136.5,12 137.5,11 T4.1 | 136.5,12 128,12 127,11 T3.1 126,11 115.5,11 T2.1 114.5,11 104,11 T1.1 103,11 95.5,11 93.5,9 83.5,9 | 136.5,12 148,12 149,11 T5.1 | 83.5,9 82.5,10 IC1.14